# Altium project MKD_V2.PrjPcb
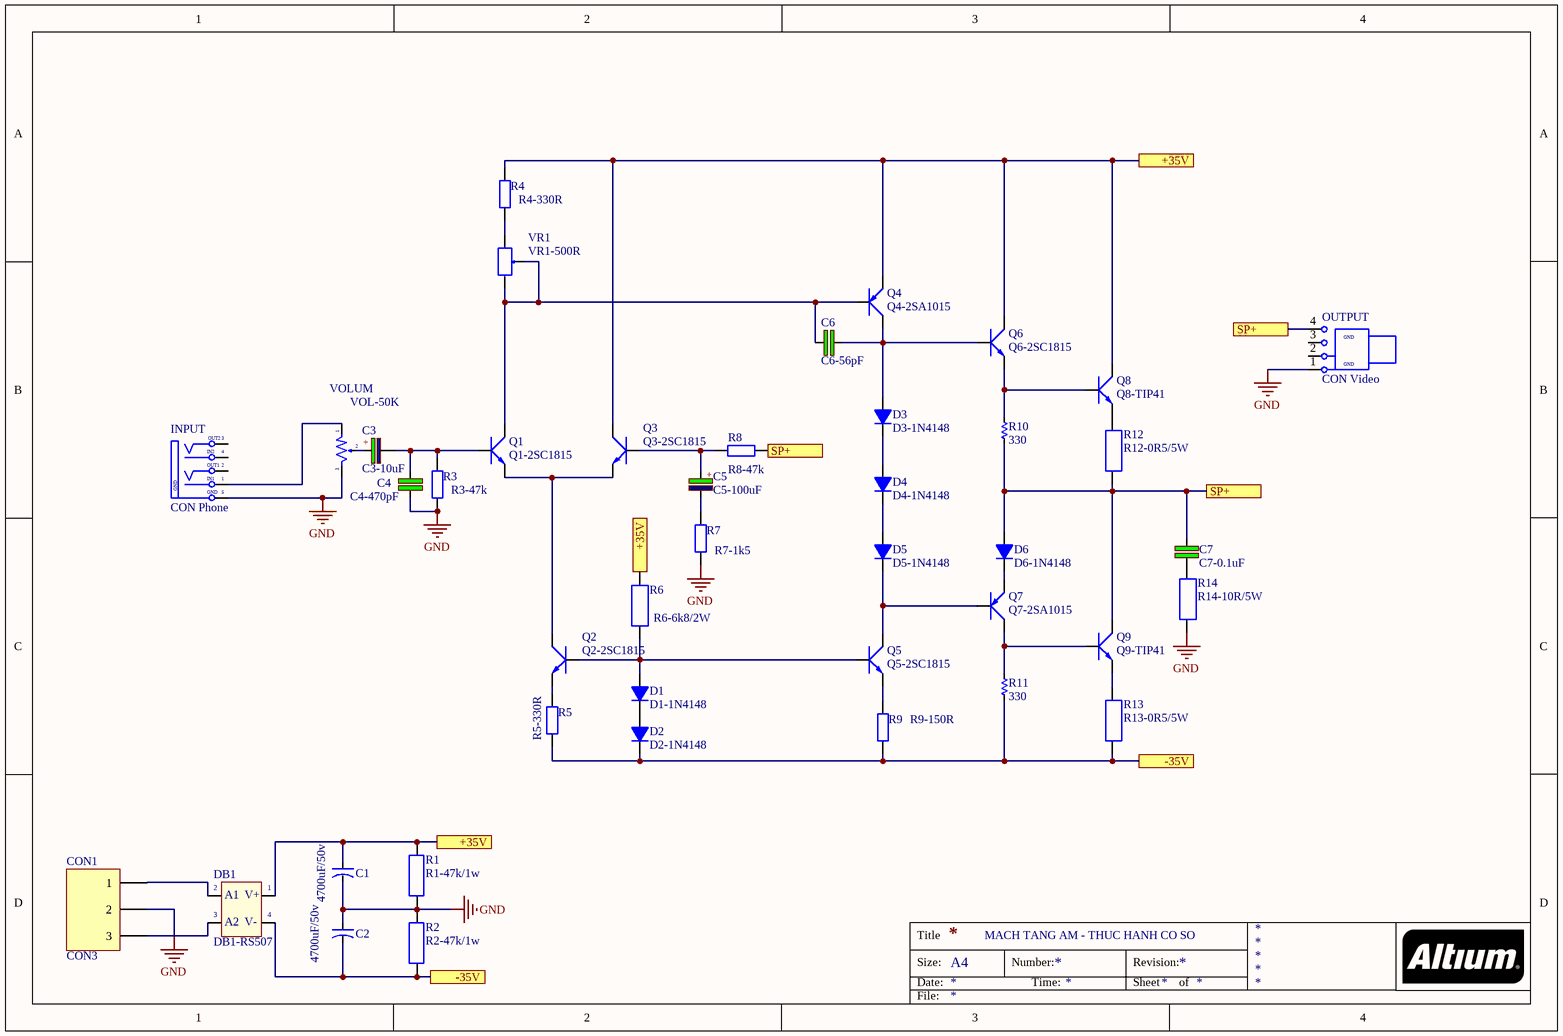
[diagram p0: Sch_MKD_V2.SchDoc]
1 sheet, 42 parts. Net scope: flat (ports and power ports of the same name join across sheets).
Board file: PCB_MKD_V2.PcbDoc

## Sheet Sch_MKD_V2.SchDoc
size A4

### Parts
C1  4700uF/50v  [CA-ALU-18]
C2  4700uF/50v  [CA-ALU-18]
C3  C3-10uF  [CP1/2]
C4  C4-470pF  [CN1.5]
C5  C5-100uF  [CP1.5/3.4]
C6  C6-56pF  [CN1.5]
C7  C7-0.1uF  [CN3]
CON1  CON3  [CON 3 5.08]
D1  D1-1N4148  [D1A]
D2  D2-1N4148  [D1A]
D3  D3-1N4148  [D1A]
D4  D4-1N4148  [D1A]
D5  D5-1N4148  [D1A]
D6  D6-1N4148  [D1A]
DB1  DB1-RS507  [DIO-Bri 5A]
INPUT  CON Phone  [CON Phone2]
OUTPUT  CON Video  [TRC-005]
Q1  Q1-2SC1815  [TO92-123]
Q2  Q2-2SC1815  [TO92-123]
Q3  Q3-2SC1815  [TO92-123]
Q4  Q4-2SA1015  [TO92-123]
Q5  Q5-2SC1815  [TO92-123]
Q6  Q6-2SC1815  [TO92-123]
Q7  Q7-2SA1015  [TO92-123]
Q8  Q8-TIP41  [QTO-220]
Q9  Q9-TIP41  [QTO-220]
R1  R1-47k/1w  [R1W]
R2  R2-47k/1w  [R1W]
R3  R3-47k  [DIEN TRO 1/4 W]
R4  R4-330R  [DIEN TRO 1/4 W]
R5  R5-330R  [DIEN TRO 1/4 W]
R6  R6-6k8/2W  [R2W]
R7  R7-1k5  [DIEN TRO 1/4 W]
R8  R8-47k  [DIEN TRO 1/4 W]
R9  R9-150R  [DIEN TRO 1/4 W]
R10  330  [RES 2W-]
R11  330  [RES 2W-]
R12  R12-0R5/5W  [R5W]
R13  R13-0R5/5W  [R5W]
R14  R14-10R/5W  [R5W]
VOLUM  VOL-50K  [VOL_SMD]
VR1  VR1-500R  [VR1]

### Ports
+35V, -35V, SP+

### Nets
GND: C1.2 C2.1 C4.1 CON1.2 INPUT.5(GND) OUTPUT.1(Black) R1.1 R2.2 R3.2 R7.1 R14.1 VOLUM.3
NetC1_1: C1.1 DB1.1(+V_OUT) Q3.2(C) Q4.1(E) Q6.2(C) Q8.2(C) R1.2 R4.1 R6.2 ; port +35V
NetC2_2: C2.2 D2.2(K) DB1.4(-V_OUT) R2.1 R5.2 R9.2 R11.2 R13.1 ; port -35V
NetC3_1: C3.1 VOLUM.2
NetC3_2: C3.2 C4.2 Q1.3(B) R3.1
NetC5_1: C5.1 Q3.3(B) R8.1
NetC5_2: C5.2 R7.2
NetC6_1: C6.1 Q1.2(C) Q4.3(B) VR1.2 VR1.3
NetC6_2: C6.2 D3.1(A) Q4.2(C) Q6.3(B)
NetC7_1: C7.1 R14.2
NetC7_2: C7.2 D6.1(A) OUTPUT.4(Red) Q9.2(C) R8.2 R10.2 R12.1 ; port SP+
NetCON1_3: CON1.3 DB1.3(AC2)
NetD1_1: D1.1(A) Q2.3(B) Q5.3(B) R6.1
NetD1_2: D1.2(K) D2.1(A)
NetD3_2: D3.2(K) D4.1(A)
NetD4_2: D4.2(K) D5.1(A)
NetD5_2: D5.2(K) Q5.2(C) Q7.3(B)
NetD6_2: D6.2(K) Q7.1(E)
NetINPUT_1: INPUT.1(S1) VOLUM.1
NetQ1_1: Q1.1(E) Q2.2(C) Q3.1(E)
NetQ2_1: Q2.1(E) R5.1
NetQ5_1: Q5.1(E) R9.1
NetQ6_1: Q6.1(E) Q8.1(B) R10.1
NetQ7_2: Q7.2(C) Q9.1(B) R11.1
NetQ8_3: Q8.3(E) R12.2
NetQ9_3: Q9.3(E) R13.2
NetR4_2: R4.2 VR1.1

Not connected (* = marked no-connect by the designer): CON1 1; DB1 2(AC1); INPUT 2(S1) 3(TN) 4(S); OUTPUT 2(Yellow) 3(White)

### Notes on the sheet
- MACH TANG AM - THUC HANH CO SO
- Title
- Size:
- Date:
- A4
- Number:
- Time:
- Revision:
- Sheet
- of
- File:
- (in symbol CON Phone2) OUT2; IN2; OUT1; IN1
- (in symbol CON Video1) GND
- (in symbol CP1) +
- (in symbol CP3) +
- (in symbol DIODE BRIGDE) A1; V+; A2; V-

### Library data of the parts
C1 C2 = CN-ALU-DIP: Capacitor (Semiconductor SIM Model); Value: 104; LatestRevisionDate: 17-Jul-2002; LatestRevisionNote: Re-released for DXP Platform.; PackageReference: C1206; Publisher: Altium Limited
C3 = CP1: Cap P  0,1uF < 22uF , 16 - 50V; Value: 10uF/50V; Description 1: 10 => 220uF/6,3V/10V - 10uF => 100uF/16V; Description 2: 0,1uF => 33uF/50V - 10uF => 22uF/63V; Description 3: 0,47uF => 10uF/100V
C4 C6 = CN1.5: Cap np 682pF => 104pF; Value: 0.01uF
C5 = CP3: Cap 100uF/35V - 470uF/16V; Value: 100uF/35V/50V; Description 1: 1000uF/6,3V - 470uF/16V - 330uF - 25V; Description 2: 220uF/35V - 100uF/50V - 63V - 4,7uF/200V; Description 3: 22uF => 33uF100V - 3,3uF => 4,7uF/250V; Description 4: 2,2uF =>3,3uF/350 - 2,2uF/400V - 1uF/450V
C7 = CN3: Cap np W0.3; Value: 0,047uF; Copyright: VanDungEvn
D1-D6 = D1A: Diode 1A; Value: 1N4007
DB1 = DIODE BRIGDE: Convert AC to DC voltage, 4 pin; Value: Cau 1A
INPUT = CON Phone2: Jac Phone Stereo; Creat by: VanDungEvn@Gmail.com
OUTPUT = CON Video1: Jac Video Stereo
Q1-Q3 Q5 Q6 = 2SC1815: NPN 600mW, ECB; Value: C1815
Q4 Q7 = 2SA1015: PNP 600mW, ECB; Value: A1015
Q8 Q9 = TIP41C: NPN 2W, BCE; Value: TIP41C
R1 R2 = R1W: Resistor 1W; Value: R1W - 100
R3 = Res 1/4 W: Resistor; Value: 47k; Published: 8-Jun-2000; LatestRevisionDate: 17-Jul-2002; LatestRevisionNote: Re-released for DXP Platform.; PackageReference: AXIAL-0.4; Publisher: Altium Limited
R4 = Res 1/4 W: Resistor; Value: 4k7; Published: 8-Jun-2000; LatestRevisionDate: 17-Jul-2002; LatestRevisionNote: Re-released for DXP Platform.; PackageReference: AXIAL-0.4; Publisher: Altium Limited
R5 = Res 1/4 W: Resistor; Value: R; Published: 8-Jun-2000; LatestRevisionDate: 17-Jul-2002; LatestRevisionNote: Re-released for DXP Platform.; PackageReference: AXIAL-0.4; Publisher: Altium Limited
R6 = R2W: Resistor 2W; Value: R2W - 47
R7 = Res 1/4 W: Resistor; Value: 1k5; Published: 8-Jun-2000; LatestRevisionDate: 17-Jul-2002; LatestRevisionNote: Re-released for DXP Platform.; PackageReference: AXIAL-0.4; Publisher: Altium Limited
R8 = Res 1/4 W: Resistor; Value: 45k; Published: 8-Jun-2000; LatestRevisionDate: 17-Jul-2002; LatestRevisionNote: Re-released for DXP Platform.; PackageReference: AXIAL-0.4; Publisher: Altium Limited
R9 = Res 1/4 W: Resistor; Value: 120R; Published: 8-Jun-2000; LatestRevisionDate: 17-Jul-2002; LatestRevisionNote: Re-released for DXP Platform.; PackageReference: AXIAL-0.4; Publisher: Altium Limited
R10 R11 = Res 2W
R12-R14 = R5W: Resistor 5W; Value: R5W - 0,47R
VOLUM = VOL-S: Var Resistor; Value: Volume 50k
VR1 = VR: Var Resistor; Value: VR 10K